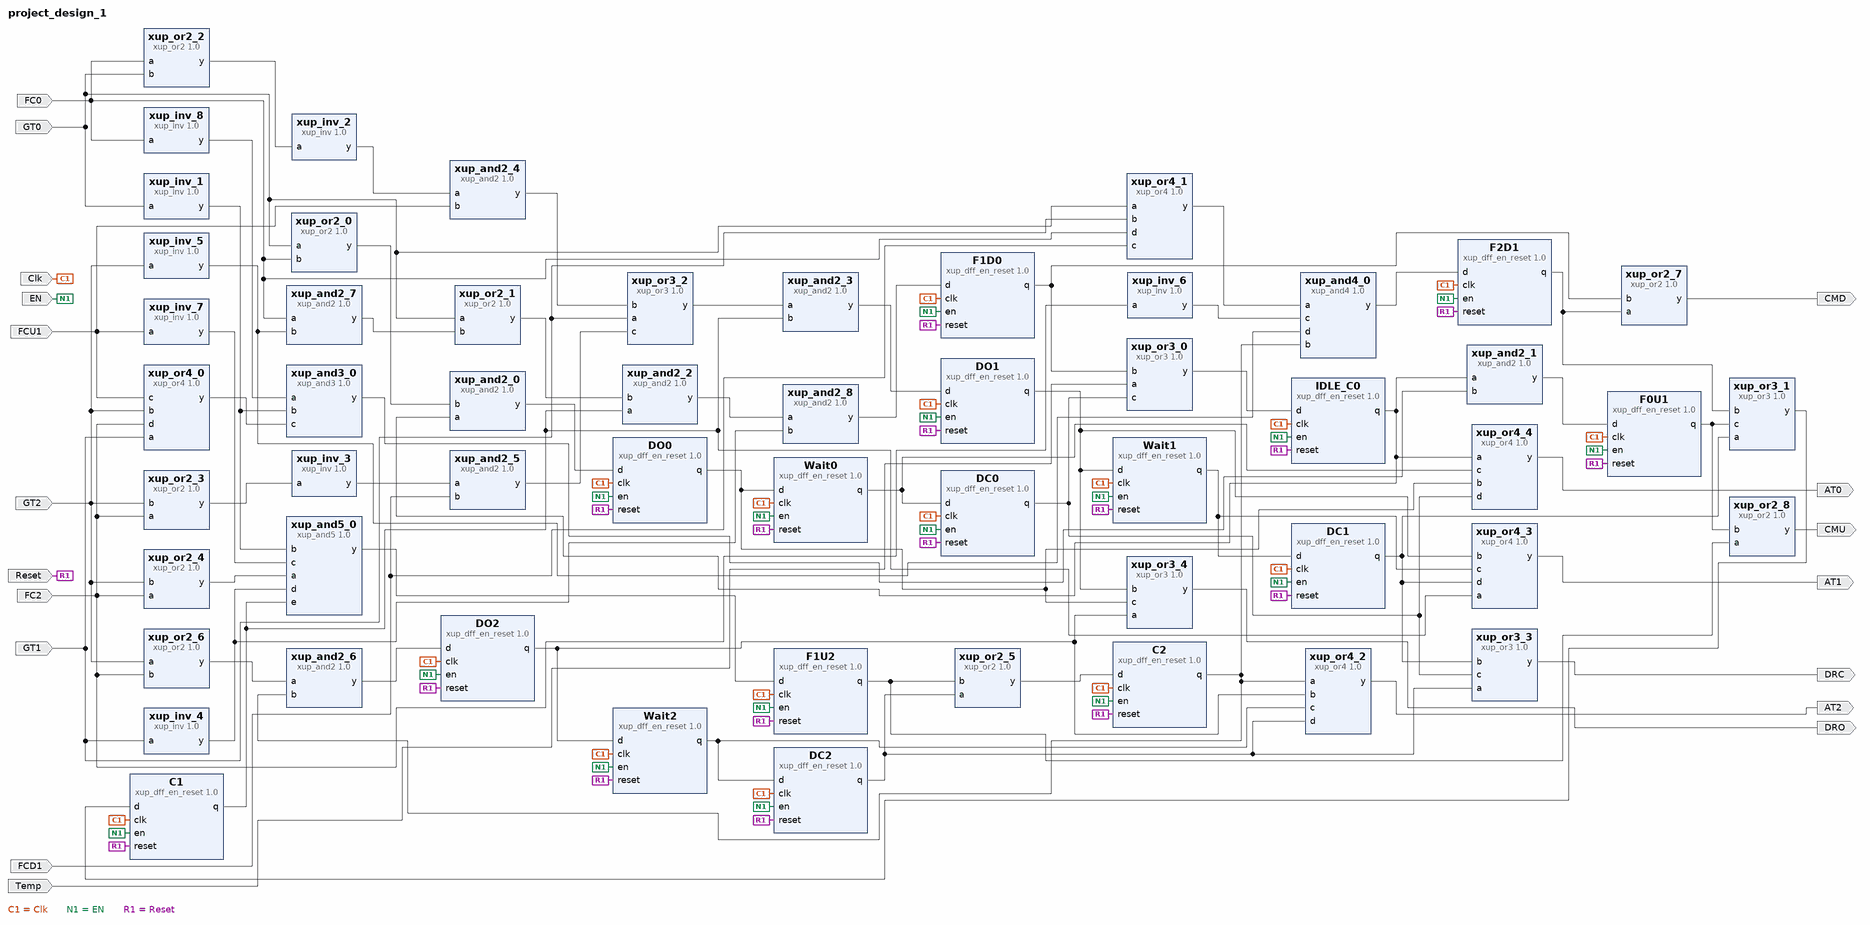
[diagram p0: block diagram of the top level]
# Vivado block design project_design_1, xc7vx485tffg1157-1, Vivado 2019.2
create_bd_design project_design_1

create_bd_port -dir I Temp
create_bd_port -dir I FC0
create_bd_port -dir I FCU1
create_bd_port -dir I FCD1
create_bd_port -dir I FC2
create_bd_port -dir I GT0
create_bd_port -dir I GT1
create_bd_port -dir I GT2
create_bd_port -dir I Reset
create_bd_port -dir I EN
create_bd_port -dir I Clk
create_bd_port -dir O CMU
create_bd_port -dir O CMD
create_bd_port -dir O AT0
create_bd_port -dir O AT1
create_bd_port -dir O AT2
create_bd_port -dir O DRO
create_bd_port -dir O DRC

create_bd_cell -type ip -vlnv xilinx.com:XUP:xup_dff_en_reset:1.0 IDLE_C0
create_bd_cell -type ip -vlnv xilinx.com:XUP:xup_dff_en_reset:1.0 DC2
create_bd_cell -type ip -vlnv xilinx.com:XUP:xup_dff_en_reset:1.0 F1D0
create_bd_cell -type ip -vlnv xilinx.com:XUP:xup_dff_en_reset:1.0 F0U1
create_bd_cell -type ip -vlnv xilinx.com:XUP:xup_dff_en_reset:1.0 F1U2
create_bd_cell -type ip -vlnv xilinx.com:XUP:xup_dff_en_reset:1.0 C1
create_bd_cell -type ip -vlnv xilinx.com:XUP:xup_dff_en_reset:1.0 DO2
create_bd_cell -type ip -vlnv xilinx.com:XUP:xup_dff_en_reset:1.0 C2
create_bd_cell -type ip -vlnv xilinx.com:XUP:xup_dff_en_reset:1.0 DO1
create_bd_cell -type ip -vlnv xilinx.com:XUP:xup_dff_en_reset:1.0 Wait1
create_bd_cell -type ip -vlnv xilinx.com:XUP:xup_dff_en_reset:1.0 DC0
create_bd_cell -type ip -vlnv xilinx.com:XUP:xup_dff_en_reset:1.0 Wait0
create_bd_cell -type ip -vlnv xilinx.com:XUP:xup_dff_en_reset:1.0 DO0
create_bd_cell -type ip -vlnv xilinx.com:XUP:xup_dff_en_reset:1.0 F2D1
create_bd_cell -type ip -vlnv xilinx.com:XUP:xup_dff_en_reset:1.0 DC1
create_bd_cell -type ip -vlnv xilinx.com:XUP:xup_dff_en_reset:1.0 Wait2
create_bd_cell -type ip -vlnv xilinx.com:XUP:xup_or3:1.0 xup_or3_0
create_bd_cell -type ip -vlnv xilinx.com:XUP:xup_or4:1.0 xup_or4_0
create_bd_cell -type ip -vlnv xilinx.com:XUP:xup_and3:1.0 xup_and3_0
create_bd_cell -type ip -vlnv xilinx.com:XUP:xup_and2:1.0 xup_and2_0
create_bd_cell -type ip -vlnv xilinx.com:XUP:xup_or2:1.0 xup_or2_0
create_bd_cell -type ip -vlnv xilinx.com:XUP:xup_inv:1.0 xup_inv_1
create_bd_cell -type ip -vlnv xilinx.com:XUP:xup_and2:1.0 xup_and2_1
create_bd_cell -type ip -vlnv xilinx.com:XUP:xup_or2:1.0 xup_or2_1
create_bd_cell -type ip -vlnv xilinx.com:XUP:xup_and2:1.0 xup_and2_2
create_bd_cell -type ip -vlnv xilinx.com:XUP:xup_or3:1.0 xup_or3_1
create_bd_cell -type ip -vlnv xilinx.com:XUP:xup_and2:1.0 xup_and2_3
create_bd_cell -type ip -vlnv xilinx.com:XUP:xup_or3:1.0 xup_or3_2
create_bd_cell -type ip -vlnv xilinx.com:XUP:xup_and2:1.0 xup_and2_4
create_bd_cell -type ip -vlnv xilinx.com:XUP:xup_and2:1.0 xup_and2_5
create_bd_cell -type ip -vlnv xilinx.com:XUP:xup_or2:1.0 xup_or2_2
create_bd_cell -type ip -vlnv xilinx.com:XUP:xup_or2:1.0 xup_or2_3
create_bd_cell -type ip -vlnv xilinx.com:XUP:xup_inv:1.0 xup_inv_2
create_bd_cell -type ip -vlnv xilinx.com:XUP:xup_inv:1.0 xup_inv_3
create_bd_cell -type ip -vlnv xilinx.com:XUP:xup_and5:1.0 xup_and5_0
create_bd_cell -type ip -vlnv xilinx.com:XUP:xup_or2:1.0 xup_or2_4
create_bd_cell -type ip -vlnv xilinx.com:XUP:xup_inv:1.0 xup_inv_4
create_bd_cell -type ip -vlnv xilinx.com:XUP:xup_or2:1.0 xup_or2_5
create_bd_cell -type ip -vlnv xilinx.com:XUP:xup_and2:1.0 xup_and2_6
create_bd_cell -type ip -vlnv xilinx.com:XUP:xup_or2:1.0 xup_or2_6
create_bd_cell -type ip -vlnv xilinx.com:XUP:xup_and4:1.0 xup_and4_0
create_bd_cell -type ip -vlnv xilinx.com:XUP:xup_or4:1.0 xup_or4_1
create_bd_cell -type ip -vlnv xilinx.com:XUP:xup_inv:1.0 xup_inv_5
create_bd_cell -type ip -vlnv xilinx.com:XUP:xup_inv:1.0 xup_inv_6
create_bd_cell -type ip -vlnv xilinx.com:XUP:xup_or2:1.0 xup_or2_7
create_bd_cell -type ip -vlnv xilinx.com:XUP:xup_or2:1.0 xup_or2_8
create_bd_cell -type ip -vlnv xilinx.com:XUP:xup_or4:1.0 xup_or4_2
create_bd_cell -type ip -vlnv xilinx.com:XUP:xup_or4:1.0 xup_or4_3
create_bd_cell -type ip -vlnv xilinx.com:XUP:xup_or4:1.0 xup_or4_4
create_bd_cell -type ip -vlnv xilinx.com:XUP:xup_or3:1.0 xup_or3_3
create_bd_cell -type ip -vlnv xilinx.com:XUP:xup_or3:1.0 xup_or3_4
create_bd_cell -type ip -vlnv xilinx.com:XUP:xup_inv:1.0 xup_inv_7
create_bd_cell -type ip -vlnv xilinx.com:XUP:xup_and2:1.0 xup_and2_8
create_bd_cell -type ip -vlnv xilinx.com:XUP:xup_and2:1.0 xup_and2_7
create_bd_cell -type ip -vlnv xilinx.com:XUP:xup_inv:1.0 xup_inv_8

# ---- connections ----

connect_bd_net [get_bd_ports Temp] [get_bd_pins xup_or3_0/a]
connect_bd_net [get_bd_pins F1D0/q] [get_bd_pins xup_or3_0/b] [get_bd_pins xup_or2_7/b]
connect_bd_net [get_bd_pins DC0/q] [get_bd_pins xup_or3_0/c] [get_bd_pins xup_or4_4/d] [get_bd_pins xup_or3_3/c]
connect_bd_net [get_bd_pins xup_or3_0/y] [get_bd_pins IDLE_C0/d]
connect_bd_net [get_bd_pins DO0/q] [get_bd_pins Wait0/d] [get_bd_pins xup_or4_4/b] [get_bd_pins xup_or3_4/c]
connect_bd_net [get_bd_pins Wait0/q] [get_bd_pins DC0/d] [get_bd_pins xup_or4_4/c]
connect_bd_net -net GT0_1 [get_bd_ports GT0] \
  [get_bd_pins xup_or2_0/a] [get_bd_pins xup_inv_1/a] [get_bd_pins xup_or2_1/a] [get_bd_pins xup_or2_2/b] \
  [get_bd_pins xup_or4_1/a]
connect_bd_net -net FC0_1 [get_bd_ports FC0] \
  [get_bd_pins xup_or2_0/b] [get_bd_pins xup_or2_2/a] [get_bd_pins xup_or4_1/d] [get_bd_pins xup_and2_7/a] \
  [get_bd_pins xup_inv_8/a]
connect_bd_net [get_bd_pins IDLE_C0/q] [get_bd_pins xup_and2_0/a] [get_bd_pins xup_and2_1/a] [get_bd_pins xup_or4_4/a]
connect_bd_net [get_bd_pins xup_or2_0/y] [get_bd_pins xup_and2_0/b]
connect_bd_net [get_bd_pins xup_and2_0/y] [get_bd_pins DO0/d]
connect_bd_net [get_bd_pins xup_or4_0/y] [get_bd_pins xup_and3_0/c]
connect_bd_net [get_bd_pins xup_inv_1/y] [get_bd_pins xup_and3_0/b] [get_bd_pins xup_and5_0/b]
connect_bd_net -net GT1_1 [get_bd_ports GT1] [get_bd_pins xup_or4_0/a] [get_bd_pins xup_or3_2/a] [get_bd_pins xup_inv_4/a] [get_bd_pins xup_or4_1/b]
connect_bd_net -net GT2_1 [get_bd_ports GT2] \
  [get_bd_pins xup_or4_0/b] [get_bd_pins xup_or2_3/b] [get_bd_pins xup_or2_4/b] [get_bd_pins xup_or2_6/a] \
  [get_bd_pins xup_inv_5/a]
connect_bd_net -net FCU1_1 [get_bd_ports FCU1] [get_bd_pins xup_or4_0/c] [get_bd_pins xup_and2_4/b] [get_bd_pins xup_inv_7/a]
connect_bd_net -net FC2_1 [get_bd_ports FC2] \
  [get_bd_pins xup_or4_0/d] [get_bd_pins xup_or2_3/a] [get_bd_pins xup_or2_4/a] [get_bd_pins xup_or2_6/b] \
  [get_bd_pins xup_inv_6/a]
connect_bd_net [get_bd_pins xup_and3_0/y] [get_bd_pins xup_and2_1/b]
connect_bd_net [get_bd_pins xup_and2_1/y] [get_bd_pins F0U1/d]
connect_bd_net [get_bd_pins C1/q] [get_bd_pins xup_and2_2/a] [get_bd_pins xup_and2_3/b] [get_bd_pins xup_and5_0/e] [get_bd_pins xup_or4_3/a]
connect_bd_net [get_bd_pins xup_or2_1/y] [get_bd_pins xup_and2_2/b]
connect_bd_net [get_bd_pins DO1/q] [get_bd_pins Wait1/d] [get_bd_pins xup_or4_3/b] [get_bd_pins xup_or3_4/b]
connect_bd_net [get_bd_pins Wait1/q] [get_bd_pins DC1/d] [get_bd_pins xup_or4_3/c]
connect_bd_net [get_bd_pins F0U1/q] [get_bd_pins xup_or3_1/c] [get_bd_pins xup_or2_8/b]
connect_bd_net [get_bd_pins F2D1/q] [get_bd_pins xup_or3_1/b] [get_bd_pins xup_or2_7/a]
connect_bd_net [get_bd_pins DC1/q] [get_bd_pins xup_or3_1/a] [get_bd_pins xup_or4_3/d] [get_bd_pins xup_or3_3/b]
connect_bd_net [get_bd_pins xup_or3_1/y] [get_bd_pins C1/d]
connect_bd_net [get_bd_pins xup_or3_2/y] [get_bd_pins xup_and2_3/a]
connect_bd_net [get_bd_pins xup_and2_3/y] [get_bd_pins DO1/d]
connect_bd_net [get_bd_pins xup_or2_2/y] [get_bd_pins xup_inv_2/a]
connect_bd_net [get_bd_pins xup_or2_3/y] [get_bd_pins xup_inv_3/a]
connect_bd_net [get_bd_pins xup_and2_4/y] [get_bd_pins xup_or3_2/b]
connect_bd_net [get_bd_pins xup_and2_5/y] [get_bd_pins xup_or3_2/c]
connect_bd_net [get_bd_pins xup_inv_2/y] [get_bd_pins xup_and2_4/a]
connect_bd_net [get_bd_pins xup_inv_3/y] [get_bd_pins xup_and2_5/a]
connect_bd_net -net FCD1_1 [get_bd_ports FCD1] [get_bd_pins xup_and2_5/b] [get_bd_pins xup_or4_1/c]
connect_bd_net [get_bd_pins xup_and5_0/y] [get_bd_pins F1U2/d]
connect_bd_net [get_bd_pins xup_inv_4/y] [get_bd_pins xup_and5_0/d] [get_bd_pins xup_and2_8/b]
connect_bd_net [get_bd_pins DO2/q] [get_bd_pins Wait2/d] [get_bd_pins xup_or4_2/b] [get_bd_pins xup_or3_4/a]
connect_bd_net [get_bd_pins Wait2/q] [get_bd_pins DC2/d] [get_bd_pins xup_or4_2/c]
connect_bd_net [get_bd_pins DC2/q] [get_bd_pins xup_or2_5/a] [get_bd_pins xup_or4_2/d] [get_bd_pins xup_or3_3/a]
connect_bd_net [get_bd_pins F1U2/q] [get_bd_pins xup_or2_5/b] [get_bd_pins xup_or2_8/a]
connect_bd_net [get_bd_pins xup_or2_5/y] [get_bd_pins C2/d]
connect_bd_net [get_bd_pins xup_or2_6/y] [get_bd_pins xup_and2_6/a]
connect_bd_net [get_bd_pins C2/q] [get_bd_pins xup_and2_6/b] [get_bd_pins xup_and4_0/b] [get_bd_pins xup_or4_2/a]
connect_bd_net [get_bd_pins xup_and2_6/y] [get_bd_pins DO2/d]
connect_bd_net [get_bd_pins xup_or4_1/y] [get_bd_pins xup_and4_0/a]
connect_bd_net [get_bd_pins xup_and4_0/y] [get_bd_pins F2D1/d]
connect_bd_net [get_bd_pins xup_inv_6/y] [get_bd_pins xup_and4_0/c]
connect_bd_net [get_bd_pins xup_inv_5/y] [get_bd_pins xup_and4_0/d] [get_bd_pins xup_and2_7/b]
connect_bd_net [get_bd_ports Clk] \
  [get_bd_pins F0U1/clk] [get_bd_pins Wait1/clk] [get_bd_pins DC1/clk] [get_bd_pins C1/clk] [get_bd_pins F1U2/clk] \
  [get_bd_pins DC2/clk] [get_bd_pins C2/clk] [get_bd_pins Wait2/clk] [get_bd_pins DO2/clk] [get_bd_pins F2D1/clk] \
  [get_bd_pins DO1/clk] [get_bd_pins F1D0/clk] [get_bd_pins DO0/clk] [get_bd_pins IDLE_C0/clk] [get_bd_pins Wait0/clk] \
  [get_bd_pins DC0/clk]
connect_bd_net [get_bd_ports EN] \
  [get_bd_pins F0U1/en] [get_bd_pins DC0/en] [get_bd_pins Wait0/en] [get_bd_pins IDLE_C0/en] [get_bd_pins Wait1/en] \
  [get_bd_pins DC1/en] [get_bd_pins C1/en] [get_bd_pins F1U2/en] [get_bd_pins DC2/en] [get_bd_pins Wait2/en] \
  [get_bd_pins C2/en] [get_bd_pins DO2/en] [get_bd_pins DO1/en] [get_bd_pins DO0/en] [get_bd_pins F1D0/en] \
  [get_bd_pins F2D1/en]
connect_bd_net [get_bd_ports Reset] \
  [get_bd_pins F0U1/reset] [get_bd_pins DC0/reset] [get_bd_pins Wait0/reset] [get_bd_pins IDLE_C0/reset] \
  [get_bd_pins Wait1/reset] [get_bd_pins DC1/reset] [get_bd_pins C1/reset] [get_bd_pins F1U2/reset] [get_bd_pins DC2/reset] \
  [get_bd_pins Wait2/reset] [get_bd_pins C2/reset] [get_bd_pins DO2/reset] [get_bd_pins F2D1/reset] [get_bd_pins DO1/reset] \
  [get_bd_pins F1D0/reset] [get_bd_pins DO0/reset]
connect_bd_net [get_bd_pins xup_or2_8/y] [get_bd_ports CMU]
connect_bd_net [get_bd_pins xup_or2_7/y] [get_bd_ports CMD]
connect_bd_net [get_bd_pins xup_or4_2/y] [get_bd_ports AT2]
connect_bd_net [get_bd_pins xup_or4_3/y] [get_bd_ports AT1]
connect_bd_net [get_bd_pins xup_or4_4/y] [get_bd_ports AT0]
connect_bd_net [get_bd_pins xup_or3_3/y] [get_bd_ports DRC]
connect_bd_net [get_bd_pins xup_or3_4/y] [get_bd_ports DRO]
connect_bd_net [get_bd_pins xup_inv_7/y] [get_bd_pins xup_and5_0/c]
connect_bd_net [get_bd_pins xup_and2_2/y] [get_bd_pins xup_and2_8/a]
connect_bd_net [get_bd_pins xup_or2_4/y] [get_bd_pins xup_and5_0/a]
connect_bd_net [get_bd_pins xup_and2_8/y] [get_bd_pins F1D0/d]
connect_bd_net [get_bd_pins xup_and2_7/y] [get_bd_pins xup_or2_1/b]
connect_bd_net [get_bd_pins xup_inv_8/y] [get_bd_pins xup_and3_0/a]

validate_bd_design
save_bd_design
